# Altium schematic sheet Sheet2.SchDoc
size A4
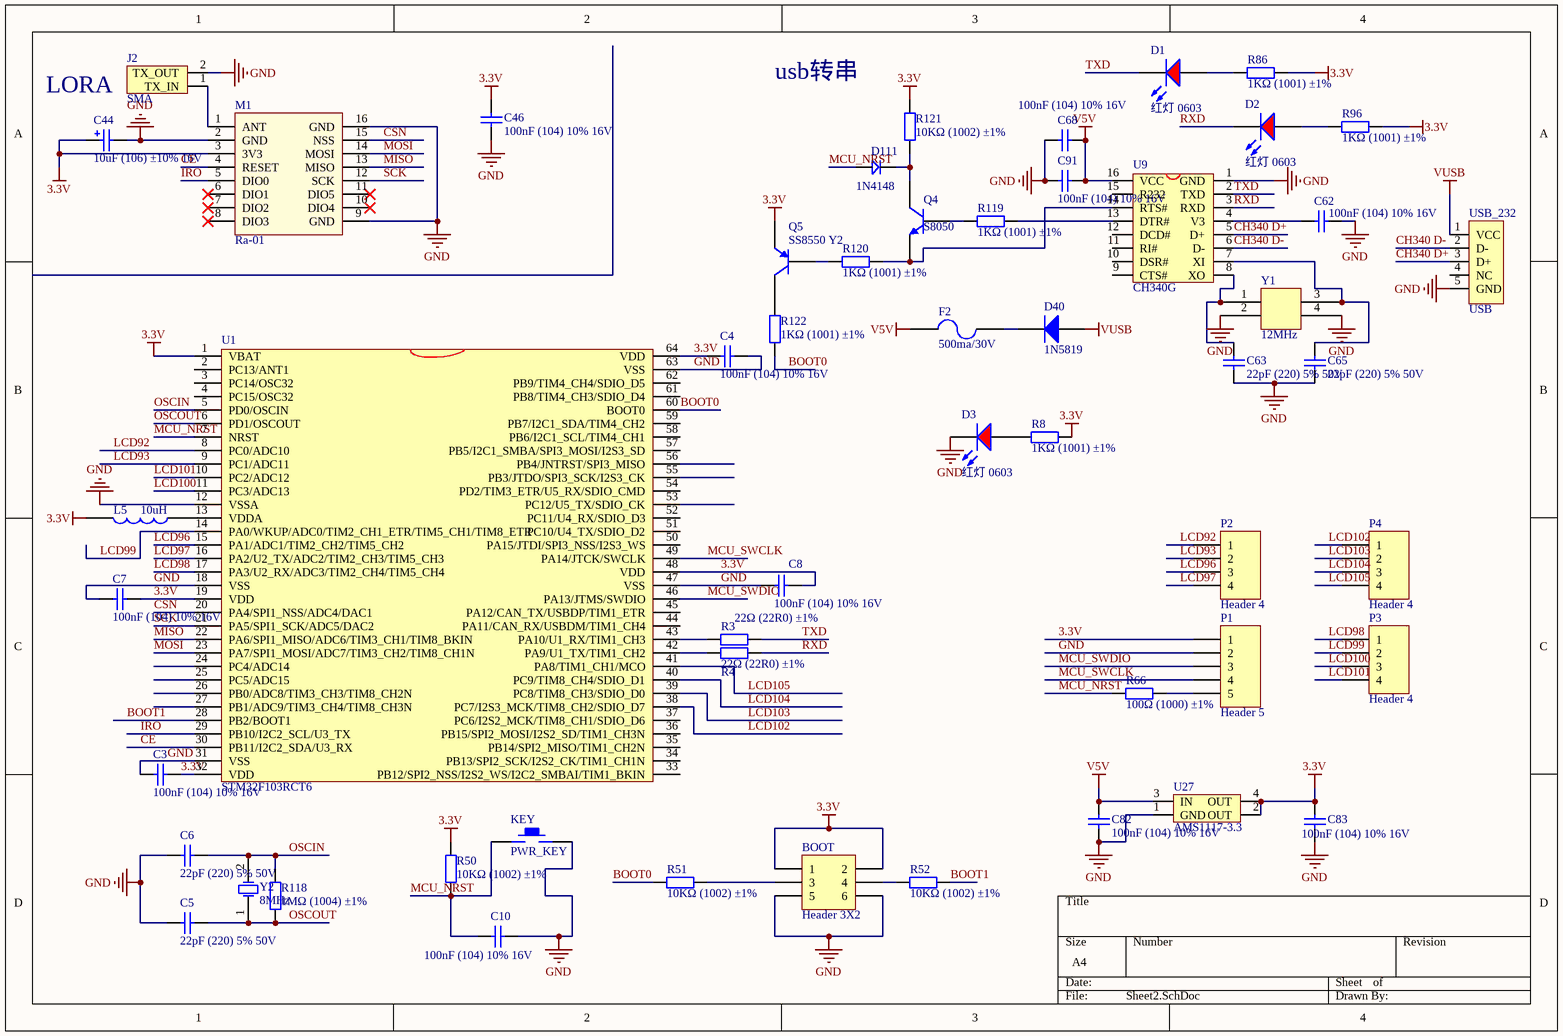
[diagram p0: Sheet2.SchDoc]

## Parts
BOOT  Header 3X2  [HDR2X3]
C3  100nF (104) 10% 16V  [0402_C]
C4  100nF (104) 10% 16V  [0402_C]
C5  22pF (220) 5% 50V  [0402_C]
C6  22pF (220) 5% 50V  [0402_C]
C7  100nF (104) 10% 16V  [0402_C]
C8  100nF (104) 10% 16V  [0402_C]
C10  100nF (104) 10% 16V  [0402_C]
C44  10uF (106) ±10% 16V  [CASE-A_3216]
C46  100nF (104) 10% 16V  [0402_C]
C62  100nF (104) 10% 16V  [0402_C]
C63  22pF (220) 5% 50V  [0402_C]
C65  22pF (220) 5% 50V  [0402_C]
C68  100nF (104) 10% 16V  [0402_C]
C82  100nF (104) 10% 16V  [0402_C]
C83  100nF (104) 10% 16V  [0402_C]
C91  100nF (104) 10% 16V  [0402_C]
D1  红灯 0603  [0603_LED_S1]
D2  红灯 0603  [0603_LED_S1]
D3  红灯 0603  [0603_LED_S1]
D40  1N5819  [LED-3528]
D111  1N4148  [DIODE_SOP]
F2  500ma/30V  [1812]
J2  SMA  [SMA-2]
KEY  PWR_KEY  [PCBComponent_1]
L5  10uH  [0805_L]
M1  Ra-01  [Ra-01 Module]
P1  Header 5  [HDR1X5]
P2  Header 4  [HDR1X4]
P3  Header 4  [HDR1X4]
P4  Header 4  [HDR1X4]
Q4  S8050  [SOT-23R]
Q5  SS8550 Y2  [SOT-23(SOT-23-3)]
R3  22Ω (22R0) ±1%  [0402_R]
R4  22Ω (22R0) ±1%  [0402_R]
R8  1KΩ (1001) ±1%  [0402_R]
R50  10KΩ (1002) ±1%  [0402_R]
R51  10KΩ (1002) ±1%  [0402_R]
R52  10KΩ (1002) ±1%  [0402_R]
R66  100Ω (1000) ±1%  [0402_R]
R86  1KΩ (1001) ±1%  [0402_R]
R96  1KΩ (1001) ±1%  [0402_R]
R118  1MΩ (1004) ±1%  [0402_R]
R119  1KΩ (1001) ±1%  [0402_R]
R120  1KΩ (1001) ±1%  [0402_R]
R121  10KΩ (1002) ±1%  [0402_R]
R122  1KΩ (1001) ±1%  [0402_R]
U1  STM32F103RCT6  [LQFP-64_10x10x05P]
U9  CH340G  [SOP16M]
U27  AMS1117-3.3  [AMS1117]
USB_232  USB  [PCBComponent_1]
Y1  12MHz  [LC-SMD-3225_4P]
Y2  8MHz  [PCBComponent_1]

## Nets
3.3V: BOOT.1 BOOT.2 C3.2 C4.1 C7.2 C8.2 C44.1 C46.2 C83.2 L5.1 M1.3(3V3) P1.1 Q5.2(E) R8.2 R50.2 R86.2 R96.2 R121.2 U1.1(VBAT) U1.19(VDD) U1.32(VDD) U1.48(VDD) U1.64(VDD) U27.2(OUT) U27.4(OUT)
GND: BOOT.5 BOOT.6 C3.1 C4.2 C5.2 C6.2 C7.1 C8.1 C10.2 C44.2 C46.1 C62.2 C63.1 C65.1 C68.1 C82.1 C83.1 C91.1 D3.K J2.2(TX_OUT) KEY.2 M1.2(GND) M1.9(GND) M1.16(GND) P1.2 U1.12(VSSA) U1.18(VSS) U1.31(VSS) U1.47(VSS) U1.63(VSS) U9.1(GND) U27.1(GND) USB_232.5(GND) Y1.2 Y1.4
V5V: C68.2 C82.2 C91.2 F2.1 U9.16(VCC) U27.3(IN)
VUSB: D40.1(A) USB_232.1(VCC)
BOOT0: R51.2 R122.1 U1.60(BOOT0)
BOOT1: R52.1 U1.28(PB2/BOOT1)
CE: M1.4(RESET) U1.30(PB11/I2C2_SDA/U3_RX)
CH340 D+: U9.5(D+) USB_232.3(D+)
CH340 D-: U9.6(D-) USB_232.2(D-)
CSN: M1.15(NSS) U1.20(PA4/SPI1_NSS/ADC4/DAC1)
IRO: M1.5(DIO0) U1.29(PB10/I2C2_SCL/U3_TX)
LCD92: P2.1 U1.8(PC0/ADC10)
LCD93: P2.2 U1.9(PC1/ADC11)
LCD96: P2.3 U1.15(PA1/ADC1/TIM2_CH2/TIM5_CH2)
LCD97: P2.4 U1.16(PA2/U2_TX/ADC2/TIM2_CH3/TIM5_CH3)
LCD98: P3.1 U1.17(PA3/U2_RX/ADC3/TIM2_CH4/TIM5_CH4)
LCD99: P3.2 U1.14(PA0/WKUP/ADC0/TIM2_CH1_ETR/TIM5_CH1/TIM8_ETR)
LCD100: P3.3 U1.11(PC3/ADC13)
LCD101: P3.4 U1.10(PC2/ADC12)
LCD102: P4.1 U1.38(PC7/I2S3_MCK/TIM8_CH2/SDIO_D7)
LCD103: P4.2 U1.39(PC8/TIM8_CH3/SDIO_D0)
LCD104: P4.3 U1.40(PC9/TIM8_CH4/SDIO_D1)
LCD105: P4.4 U1.41(PA8/TIM1_CH1/MCO)
MCU_NRST: C10.1 D111.1 KEY.1 R50.1 R66.1 U1.7(NRST)
MCU_SWCLK: P1.4 U1.49(PA14/JTCK/SWCLK)
MCU_SWDIO: P1.3 U1.46(PA13/JTMS/SWDIO)
MISO: M1.13(MISO) U1.22(PA6/SPI1_MISO/ADC6/TIM3_CH1/TIM8_BKIN)
MOSI: M1.14(MOSI) U1.23(PA7/SPI1_MOSI/ADC7/TIM3_CH2/TIM8_CH1N)
OSCIN: C6.1 R118.2 U1.5(PD0/OSCIN) Y2.2(OSC2)
OSCOUT: C5.1 R118.1 U1.6(PD1/OSCOUT) Y2.1(OSC1)
RXD: D2.K R4.2 U9.3(RXD)
SCK: M1.12(SCK) U1.21(PA5/SPI1_SCK/ADC5/DAC2)
TXD: D1.K R3.2 U9.2(TXD)
NetBOOT_3: BOOT.3 R51.1
NetBOOT_4: BOOT.4 R52.2
NetC62_1: C62.1 U9.4(V3)
NetC63_2: C63.2 U9.8(XO) Y1.1
NetC65_2: C65.2 U9.7(XI) Y1.3
NetD1_A: D1.A R86.1
NetD2_A: D2.A R96.1
NetD3_A: D3.A R8.1
NetD40_2: D40.2(K) F2.2
NetD111_2: D111.2 Q4.1(C) R121.1
NetJ2_1: J2.1(TX_IN) M1.1(ANT)
NetL5_2: L5.2 U1.13(VDDA)
NetP1_5: P1.5 R66.2
NetQ4_2: Q4.2(B) R119.1
NetQ4_3: Q4.3(E) R120.2 U9.14(RTS#)
NetQ5_1: Q5.1(B) R120.1
NetQ5_3: Q5.3(C) R122.2
NetR3_1: R3.1 U1.43(PA10/U1_RX/TIM1_CH3)
NetR4_1: R4.1 U1.42(PA9/U1_TX/TIM1_CH2)
NetR119_2: R119.2 U9.13(DTR#)

Not connected (* = marked no-connect by the designer): M1 6(DIO1)* 7(DIO2)* 8(DIO3)* 10(DIO4)* 11(DIO5)*; U1 2(PC13/ANT1) 3(PC14/OSC32) 4(PC15/OSC32) 24(PC4/ADC14) 25(PC5/ADC15) 26(PB0/ADC8/TIM3_CH3/TIM8_CH2N) 27(PB1/ADC9/TIM3_CH4/TIM8_CH3N) 33(PB12/SPI2_NSS/I2S2_WS/I2C2_SMBAI/TIM1_BKIN) 34(PB13/SPI2_SCK/I2S2_CK/TIM1_CH1N) 35(PB14/SPI2_MISO/TIM1_CH2N) 36(PB15/SPI2_MOSI/I2S2_SD/TIM1_CH3N) 37(PC6/I2S2_MCK/TIM8_CH1/SDIO_D6) 44(PA11/CAN_RX/USBDM/TIM1_CH4) 45(PA12/CAN_TX/USBDP/TIM1_ETR) 50(PA15/JTDI/SPI3_NSS/I2S3_WS) 51(PC10/U4_TX/SDIO_D2) 52(PC11/U4_RX/SDIO_D3) 53(PC12/U5_TX/SDIO_CK) 54(PD2/TIM3_ETR/U5_RX/SDIO_CMD) 55(PB3/JTDO/SPI3_SCK/I2S3_CK) 56(PB4/JNTRST/SPI3_MISO) 57(PB5/I2C1_SMBA/SPI3_MOSI/I2S3_SD) 58(PB6/I2C1_SCL/TIM4_CH1) 59(PB7/I2C1_SDA/TIM4_CH2) 61(PB8/TIM4_CH3/SDIO_D4) 62(PB9/TIM4_CH4/SDIO_D5); U9 9(CTS#) 10(DSR#) 11(RI#) 12(DCD#) 15(R232); USB_232 4(NC)

## Notes on the sheet
- (near C44) LORA
- usb转串

## Library data of the parts
BOOT = Header 3: Header, 3-Pin, Dual row; LatestRevisionDate: 17-Jul-2002; LatestRevisionNote: Re-released for DXP Platform.; Publisher: Altium Limited
C3 C4 C7 C8 C10 C46 C62 C68 C82 C83 C91 = 0402 100nF (104) 10% : 贴片电容; ComponentLink1Description: 供应商链接; ComponentLink1URL: http://www.szlcsc.com/product/details_1877.html; Package: 0402; Supplier: LC; SuppliersPartNumber: C1525
C5 C6 C63 C65 = 0402 22pF (220) 5% : 贴片电容; ComponentLink1Description: 供应商链接; ComponentLink1URL: http://www.szlcsc.com/product/details_1907.html; Package: 0402; Supplier: LC; SuppliersPartNumber: C1555
C44 = 3216 10uF (106) 10% 1: 钽电容; ComponentLink1Description: 供应商链接; ComponentLink1URL: http://www.szlcsc.com/product/details_7643.html; Package: 3216; Supplier: LC; SuppliersPartNumber: C7171
D1-D3 = 0: 发光二极管; ComponentLink1Description: 供应商链接; ComponentLink1URL: http://www.szlcsc.com/product/details_2659.html; Package: 0603; Supplier: LC; SuppliersPartNumber: C2286
D40 = Diode 1N4001: 1 Amp General Purpose Rectifier; Published: 8-Jun-2000; LatestRevisionDate: 17-Jul-2002; LatestRevisionNote: Re-released for DXP Platform.; DatasheetVersion: 1998; PackageVersion: Aug-1999; PackageReference: DO-41; Publisher: Altium Limited; Code_JEDEC: DO-204-AL; ComponentLink1Description: Manufacturer Link; ComponentLink1URL: http://www.fairchildsemi.com/; ComponentLink2Description: Datasheet; ComponentLink2URL: http://www.fairchildsemi.com/ds/1N%2F1N4001.pdf
D111 = D
F2 = FUSE2: Fuse
J2 = SMA-2
KEY = KEY_M
L5 = INDUCTOR1
M1 = Ra-01 Module
P1 = Header 5: Header, 5-Pin; LatestRevisionDate: 17-Jul-2002; LatestRevisionNote: Re-released for DXP Platform.; Publisher: Altium Limited
P2-P4 = Header: Header, 4-Pin; LatestRevisionDate: 17-Jul-2002; LatestRevisionNote: Re-released for DXP Platform.; Publisher: Altium Limited
Q4 = QNPN: NPN Bipolar Transistor; Published: 8-Jun-2000; LatestRevisionDate: 29-May-2009; LatestRevisionNote: IPC-7351 Footprint Added.; PackageVersion: Aug-1999; PackageReference: SOT-23B; Publisher: Altium Limited; PackageDescription: 3-Pin SOT-23 Package 0.95 mm Pitch, 2.4 mm Lead Span
Q5 = SOT-23 SS8550 : 三极管; ComponentLink1Description: 供应商链接; ComponentLink1URL: http://www.szlcsc.com/product/details_9037.html; Package: SOT-23; Supplier: LC; SuppliersPartNumber: C8542
R3 R4 = 0402 22Ω (22R: 贴片电阻; ComponentLink1Description: 供应商链接; ComponentLink1URL: http://www.szlcsc.com/product/details_25835.html; Package: 0402; Supplier: LC; SuppliersPartNumber: C25092
R8 R86 R96 R119 R120 R122 = 0402 1KΩ (100: 贴片电阻; ComponentLink1Description: 供应商链接; ComponentLink1URL: http://www.szlcsc.com/product/details_12256.html; Package: 0402; Supplier: LC; SuppliersPartNumber: C11702
R50-R52 R121 = 0402 10KΩ (100: 贴片电阻; ComponentLink1Description: 供应商链接; ComponentLink1URL: http://www.szlcsc.com/product/details_26487.html; Package: 0402; Supplier: LC; SuppliersPartNumber: C25744
R66 = 0402 100Ω (100: 贴片电阻; ComponentLink1Description: 供应商链接; ComponentLink1URL: http://www.szlcsc.com/product/details_25819.html; Package: 0402; Supplier: LC; SuppliersPartNumber: C25076
R118 = 0402 1MΩ (100: 贴片电阻; ComponentLink1Description: 供应商链接; ComponentLink1URL: http://www.szlcsc.com/product/details_26826.html; Package: 0402; Supplier: LC; SuppliersPartNumber: C26083
U1 = STM32F103RD
U9 = CH340G: USB2UART
U27 = AMS1117
USB_232 = US
Y1 = Component_
Y2 = XT: Crystal Oscillator; Published: 8-Jun-2000; LatestRevisionDate: 17-Jul-2002; LatestRevisionNote: Re-released for DXP Platform.; Publisher: Altium Limited